# EasyEDA Pro project PCB.eprj, board PCB5
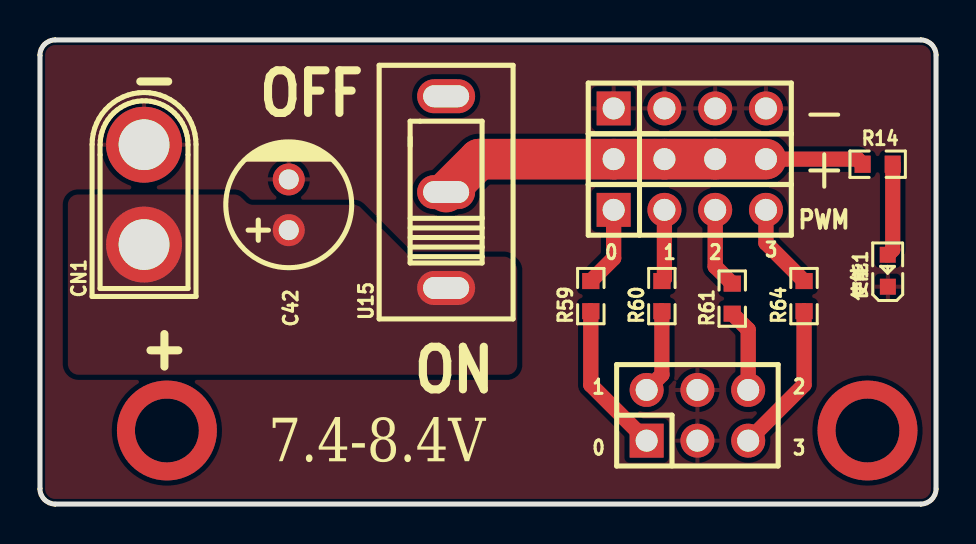
[diagram p3: board, top side]
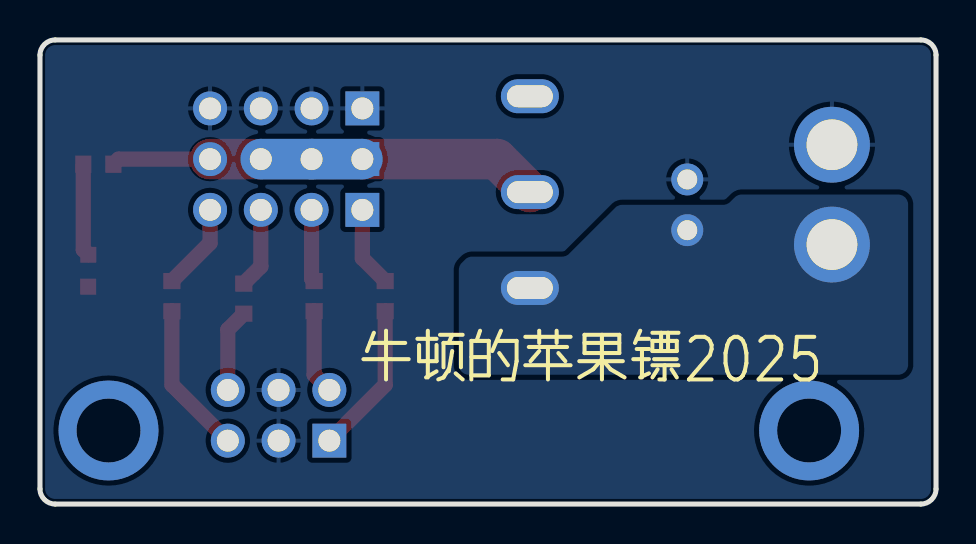
[diagram p4: board, bottom side, seen from below]

Outline 44.83 x 23.24 mm; copper layers: Top Layer, Bottom Layer. Coordinates in mm from the lower left corner of the outline.
Outline path: 0,22.48 0,0.76 arc(0.22,0.22) 0.76,0 44.07,0 arc(44.61,0.22) 44.83,0.76 44.83,22.48 arc(44.61,23.02) 44.07,23.24 0.76,23.24 arc(0.22,23.02) 0,22.48
Stack: Top Layer 0.035mm / Dielectric1 1.51mm FR4 er 4.5 / Bottom Layer 0.035mm

## Design rules (mm)
template: 自定义配置
spacing copperThickness1oz (default): track to track 0.102, other pairs 0.152 to 0.3
spacing copperThickness2oz: track to track 0.203, other pairs 0.152 to 0.3
track width copperThickness1oz (default): min 0.127, default 0.254, max 2.54
track width copperThickness2oz: min 0.203, default 0.254, max 2.54
differential pair differentialPair (default): width min 0.127, default 0.254, max 2.54; gap min 0.152, default 0.152
via viaSize (default): diameter min 0.5, default 0.61, max 10; hole min 0.3, default 0.305, max 6.3
net VIN uses 普通直连焊盘

## Placement (name value [footprint] x y rotation side)
C42  220uF  [CAP-TH_BD6.3-P2.50-D1.0-FD]  12.45 14.99 90 top
CN1  XT30U-M  [CONN-TH_XT30U-M]  5.21 15.49 90 top
H4  PZ254V-11-04P  [HDR-TH_4P-P2.54-V-M]  32.51 14.73 0 top
H5  PZ254V-11-04P  [HDR-TH_4P-P2.54-V-M]  32.51 17.27 0 top
H6  PZ254V-11-04P  [HDR-TH_4P-P2.54-V-M]  32.51 19.81 0 top
H7  PZ254V-12-6P  [HDR-TH_6P-P2.54-V-M-R2-C3-S2.54]  32.89 4.44 0 top
R14  330Ω  [R0603]  41.91 17.02 180 top
R59  100Ω  [R0603]  27.56 10.41 90 top
R60  100Ω  [R0603]  31.11 10.41 90 top
R61  100Ω  [R0603]  34.63 10.29 90 top
R64  100Ω  [R0603]  38.23 10.41 90 top
U15  SS12D10G5  [SW-TH_SHOU-HAN_SS12D10G4]  20.32 15.62 90 top
使能1  NCD0603R1  [LED0603-RD_RED]  42.42 11.68 90 top

## Footprints (pads in the part's own frame, mm; a bottom-side part is the same pattern mirrored in y, then rotated)
CAP-TH_BD6.3-P2.50-D1.0-FD
  round 1.6 hole 1: 1(-1.27,0) 2(1.27,0)
CONN-TH_XT30U-M
  round 3.8 hole 2.54: 1(-2.5,0) 2(2.5,0)
HDR-TH_4P-P2.54-V-M
  rect 1.7x1.7 hole 1.1: 1(-3.81,0)
  round 1.7 hole 1.1: 2(-1.27,0) 3(1.27,0) 4(3.81,0)
HDR-TH_6P-P2.54-V-M-R2-C3-S2.54
  rect 1.7x1.7 hole 1.1: 1(-2.54,-1.27)
  round 1.7 hole 1.1: 2(-2.54,1.27) 3(0,-1.27) 4(0,1.27) 5(2.54,-1.27) 6(2.54,1.27)
LED0603-RD_RED
  rect 0.8x0.8 smd: 1(-0.799,-0.004) 2(0.799,0.004)
R0603
  rect 0.806x0.864 smd: 1(-0.753,0) 2(0.753,0)
SW-TH_SHOU-HAN_SS12D10G4
  oval 1.7x2.9 hole 1.1x2.3: 1(-4.8,0) 2(0,0) 3(4.8,0)

## Nets
As in the schematic.

Pads without a net: U15 3

## Via types
v1: diameter 5, hole 3.2, Top Layer to Bottom Layer, 2 vias

## Routing (per net, layer and track width the routed paths; a pad name or vN(x,y) marks a point on that pad's centre or on a via; arc(x,y) is an arc through that point)
VCCSREER: length 26.7
  Top Layer w0.762: R14.2 40.9,17.27 H5.4
  Top Layer w2.032: U15.2 21.97,17.27 H5.1 H5.2 H5.4
  Bottom Layer w2.032: H5.1 H5.2 33.78,17.27
(no net):
  vias: v1(6.35,3.68) v1(41.4,3.68)
P00.0: length 4
  Top Layer w0.762: R59.2 28.7,12.31 H4.1
P00.1: length 3.6
  Top Layer w0.762: H4.2 31.24,11.29 R60.2
P00.3: length 4
  Top Layer w0.762: 33.78,14.73 33.78,11.89 R61.2
P00.4: length 4.4
  Top Layer w0.762: H4.4 36.32,13.07 R64.2
PWM1: length 7.6
  Top Layer w0.762: H7.1 27.56,5.97 R59.1
PWM2: length 4.3
  Top Layer w0.762: R60.1 31.11,6.48 H7.2
PWM3: length 4.1
  Top Layer w0.762: R61.1 35.43,8.74 H7.6
PWM4: length 7.6
  Top Layer w0.762: R64.1 38.23,5.97 H7.5
$1N2069: length 4.6
  Top Layer w0.762: 使能1.2 42.66,12.73 R14.1

## Copper pours and planes (outline as drawn; the poured copper is in the pictures)
GND on Top Layer: -2.54,26.67 46.61,26.67 46.61,-2.67 -2.54,-2.67
GND on Bottom Layer: -1.91,25.27 46.99,25.27 46.99,-1.52 -1.91,-1.52
VIN on Top Layer: 1.4,14.99 1.55,15.35 1.91,15.5 9.72,15.5 9.91,15.46 10.08,15.35 10.29,15.13 10.46,15.02 10.65,14.99 15.69,14.99 15.89,14.95 16.05,14.84 18.35,12.54 18.52,12.43 18.71,12.39 23.21,12.39 23.4,12.35 23.57,12.24 23.73,12.08 23.84,11.91 23.88,11.72 23.88,6.97 23.73,6.62 23.37,6.48 1.91,6.48 1.54,6.65 1.4,7.03
VIN on Bottom Layer: 1.4,14.99 1.55,15.35 1.91,15.5 9.72,15.5 9.91,15.46 10.08,15.35 10.29,15.13 10.46,15.02 10.65,14.99 15.69,14.99 15.89,14.95 16.05,14.84 18.35,12.54 18.52,12.43 18.71,12.39 23.21,12.39 23.4,12.35 23.57,12.24 23.73,12.08 23.84,11.91 23.88,11.72 23.88,6.97 23.73,6.62 23.37,6.48 1.91,6.48 1.55,6.62 1.4,6.98

## Text on the board
Bottom Silkscreen Layer: 牛顿的苹果镖2025
Top Silkscreen Layer: 1 | 0 | 2 | 3 | PWM | - | + | OFF | ON | 7.4-8.4V
